# Altium schematic sheet MAIN_SCHE.SchDoc
size A3
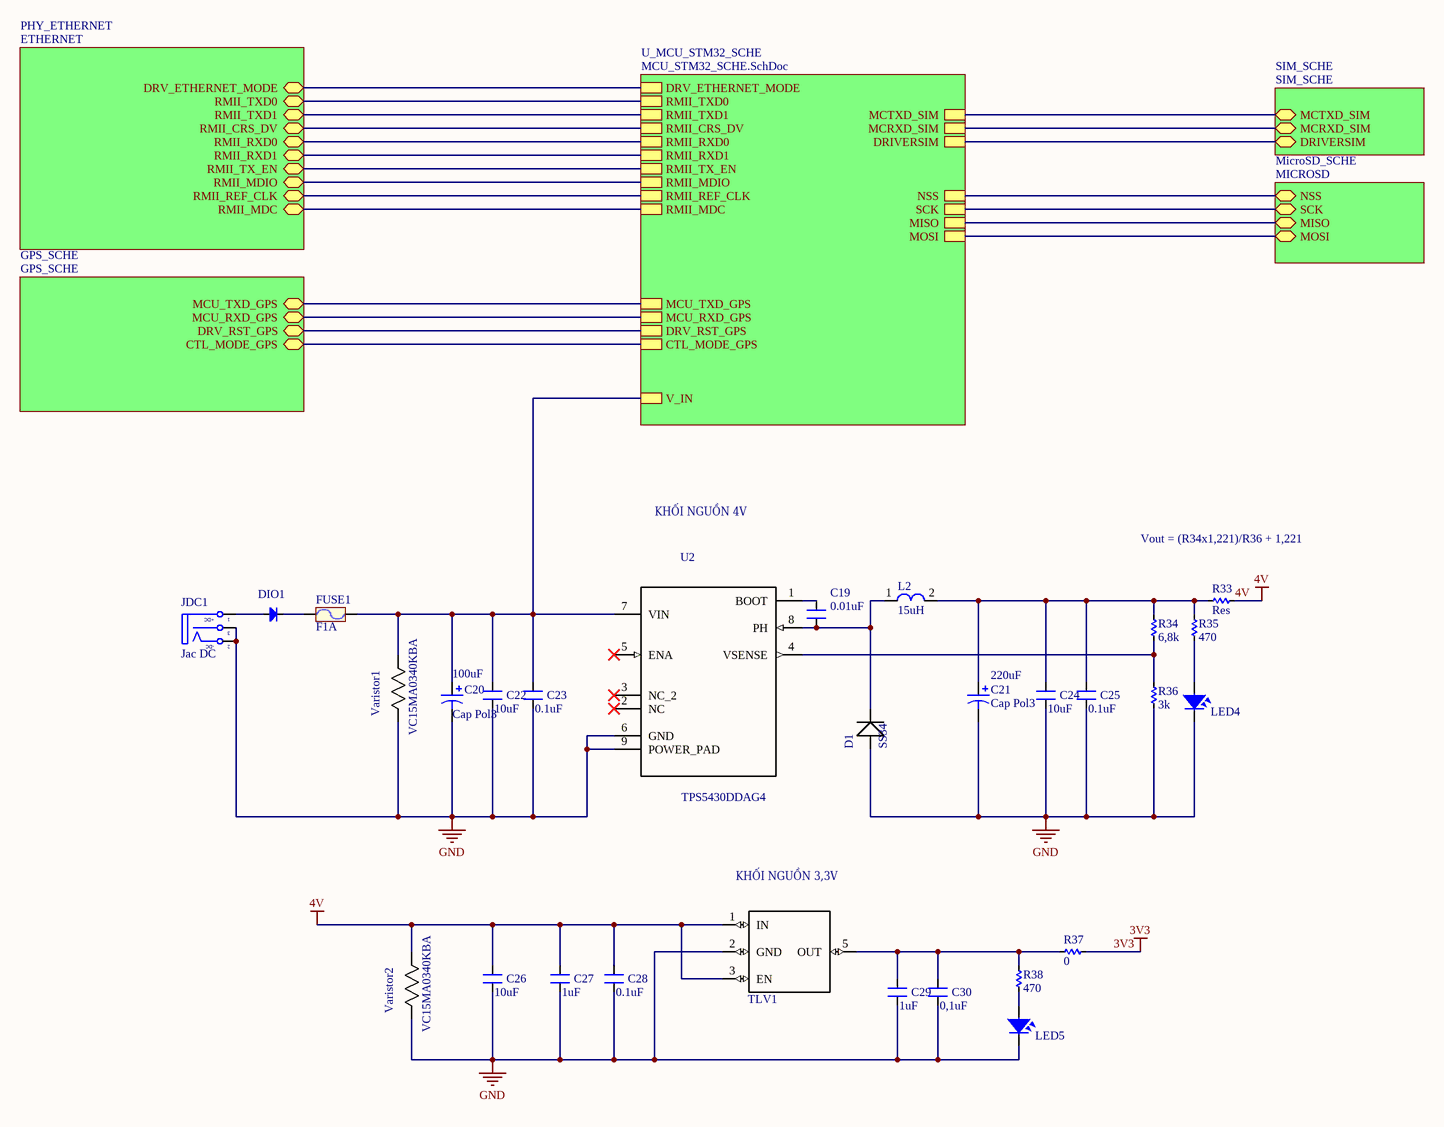
[diagram p0: MAIN_SCHE.SchDoc]

## Parts
C19  0.01uF  [res 0805 - duplicate]
C20  Cap Pol3  value 100uF  [cap_100uf]
C21  Cap Pol3  value 220uF  [Cap_tant_220uF]
C22  10uF  [res 0805 - duplicate]
C23  0.1uF  [res 0805 - duplicate]
C24  10uF  [res 0805 - duplicate]
C25  0.1uF  [res 0805 - duplicate]
C26  10uF  [res 0805 - duplicate]
C27  1uF  [res 0805 - duplicate]
C28  0.1uF  [res 0805 - duplicate]
C29  1uF  [res 0805 - duplicate]
C30  0,1uF  [res 0805 - duplicate]
D1  SS34  [SS34]
DIO1  Diode SMD  [DIOT-SS24]  (value not drawn)
FUSE1  F1A  [fuse]
JDC1  Jac DC  [DC-IN]
L2  15uH  [L-15uH]
LED4  LED  [res 0805 - duplicate]  (value not drawn)
LED5  LED  [res 0805 - duplicate]  (value not drawn)
R33  Res  [res 0805 - duplicate]
R34  6,8k  [res 0805 - duplicate]
R35  470  [res 0805 - duplicate]
R36  3k  [res 0805 - duplicate]
R37  0  [res 0805 - duplicate]
R38  470  [res 0805 - duplicate]
TLV1  TLV70233DBVR  [SOT23-5]  (value not drawn)
U2  TPS5430DDAG4  [SOIC127P600X170-9N]
Varistor1  VC15MA0340KBA  [varistor]
Varistor2  VC15MA0340KBA  [varistor]

## Sub-sheets
GPS_SCHE = GPS_SCHE: MCU_TXD_GPS, MCU_RXD_GPS, DRV_RST_GPS, CTL_MODE_GPS
MicroSD_SCHE = MICROSD: NSS, SCK, MISO, MOSI
PHY_ETHERNET = ETHERNET: DRV_ETHERNET_MODE, RMII_TXD0, RMII_TXD1, RMII_CRS_DV, RMII_RXD0, RMII_RXD1, RMII_TX_EN, RMII_MDIO, RMII_REF_CLK, RMII_MDC
SIM_SCHE = SIM_SCHE: MCTXD_SIM, MCRXD_SIM, DRIVERSIM
U_MCU_STM32_SCHE = MCU_STM32_SCHE.SchDoc: DRV_ETHERNET_MODE, RMII_TXD0, RMII_TXD1, RMII_CRS_DV, RMII_RXD0, RMII_RXD1, RMII_TX_EN, MCTXD_SIM, MCRXD_SIM, DRIVERSIM, MCU_TXD_GPS, MCU_RXD_GPS, DRV_RST_GPS, CTL_MODE_GPS, NSS, SCK, MISO, MOSI, RMII_MDIO, RMII_REF_CLK, RMII_MDC, V_IN

## Nets
3V3: R37.1
4V: C26.2 C27.2 C28.2 R33.1 TLV1.1(IN) TLV1.3(EN) Varistor2.1(R1)
GND: C20.2 C21.2 C22.1 C23.1 C24.1 C25.1 C26.1 C27.1 C28.1 C29.1 C30.1 D1.1(POS) JDC1.2(TN) JDC1.3(S) LED4.2 LED5.2 R36.2 TLV1.2(GND) U2.6(GND) U2.9(POWER_PAD) Varistor1.2(R2) Varistor2.2(R2)
NetC19_1: C19.1 D1.2(NEG) L2.1 U2.8(PH)
NetC19_2: C19.2 U2.1(BOOT)
NetC20_1: C20.1 C22.2 C23.2 FUSE1.2 U2.7(VIN) Varistor1.1(R1) ; sheet U_MCU_STM32_SCHE/V_IN
NetC21_1: C21.1 C24.2 C25.2 L2.2 R33.2 R34.1 R35.1
NetC29_2: C29.2 C30.2 R37.2 R38.2 TLV1.5(OUT)
NetDIO1_1: DIO1.1(A) JDC1.1(T)
NetDIO1_2: DIO1.2(K) FUSE1.1
NetLED4_1: LED4.1 R35.2
NetLED5_1: LED5.1 R38.1
NetR34_2: R34.2 R36.1 U2.4(VSENSE)
(unnamed): sheet U_MCU_STM32_SCHE/DRV_ETHERNET_MODE, sheet PHY_ETHERNET/DRV_ETHERNET_MODE
(unnamed): sheet U_MCU_STM32_SCHE/RMII_TXD0, sheet PHY_ETHERNET/RMII_TXD0
(unnamed): sheet U_MCU_STM32_SCHE/RMII_TXD1, sheet PHY_ETHERNET/RMII_TXD1
(unnamed): sheet U_MCU_STM32_SCHE/RMII_CRS_DV, sheet PHY_ETHERNET/RMII_CRS_DV
(unnamed): sheet U_MCU_STM32_SCHE/RMII_RXD0, sheet PHY_ETHERNET/RMII_RXD0
(unnamed): sheet U_MCU_STM32_SCHE/RMII_RXD1, sheet PHY_ETHERNET/RMII_RXD1
(unnamed): sheet U_MCU_STM32_SCHE/RMII_TX_EN, sheet PHY_ETHERNET/RMII_TX_EN
(unnamed): sheet U_MCU_STM32_SCHE/MCTXD_SIM, sheet SIM_SCHE/MCTXD_SIM
(unnamed): sheet U_MCU_STM32_SCHE/MCRXD_SIM, sheet SIM_SCHE/MCRXD_SIM
(unnamed): sheet U_MCU_STM32_SCHE/DRIVERSIM, sheet SIM_SCHE/DRIVERSIM
(unnamed): sheet U_MCU_STM32_SCHE/MCU_TXD_GPS, sheet GPS_SCHE/MCU_TXD_GPS
(unnamed): sheet U_MCU_STM32_SCHE/MCU_RXD_GPS, sheet GPS_SCHE/MCU_RXD_GPS
(unnamed): sheet U_MCU_STM32_SCHE/DRV_RST_GPS, sheet GPS_SCHE/DRV_RST_GPS
(unnamed): sheet U_MCU_STM32_SCHE/CTL_MODE_GPS, sheet GPS_SCHE/CTL_MODE_GPS
(unnamed): sheet U_MCU_STM32_SCHE/NSS, sheet MicroSD_SCHE/NSS
(unnamed): sheet U_MCU_STM32_SCHE/SCK, sheet MicroSD_SCHE/SCK
(unnamed): sheet U_MCU_STM32_SCHE/MISO, sheet MicroSD_SCHE/MISO
(unnamed): sheet U_MCU_STM32_SCHE/MOSI, sheet MicroSD_SCHE/MOSI
(unnamed): sheet U_MCU_STM32_SCHE/RMII_MDIO, sheet PHY_ETHERNET/RMII_MDIO
(unnamed): sheet U_MCU_STM32_SCHE/RMII_REF_CLK, sheet PHY_ETHERNET/RMII_REF_CLK
(unnamed): sheet U_MCU_STM32_SCHE/RMII_MDC, sheet PHY_ETHERNET/RMII_MDC

Not connected (* = marked no-connect by the designer): U2 2(NC)* 3(NC_2)* 5(ENA)*

## Notes on the sheet
- KHỐI NGUỒN 4V
- Vout = (R34x1,221)/R36 + 1,221
- (near TLV1) KHỐI NGUỒN 3,3V
- (in symbol DCIN) +DC; -DC

## Library data of the parts
C19 C22-C30 = CM: Cap SMD; Value: 103
C20 C21 = Cap Pol3: Polarized Capacitor (Surface Mount); Published: 8-Jun-2000; LatestRevisionDate: 29-May-2009; LatestRevisionNote: IPC-7351 Footprint Added.; PackageReference: C0805; Publisher: Altium Limited; PackageDescription: Chip Capacitor
  C20: wed: https://www.digikey.com/product-detail/en/avx-corporation/TCJE107M020R0045/478-9462-1-ND/5001674
  C21: wed: https://www.digikey.com/product-detail/en/avx-corporation/F930J227MBA/478-8168-6-ND/4006298
D1 = SMD-DIODE-SCHOTTKY-40V-3A(DO-214AB): Rectifier, Schottky; DO-214AB; 3.0A IF; 0.75V; 40V; 100A IFRM; 10000V/us; 1000pF; MF: Vishay; MP: SS34-E3/57T; Digi-Key_Part_Number: SS34-E3/57TGICT-ND; Digi-Key_Purchase_URL: https://www.digikey.com/product-detail/en/vishay-semiconductor-diodes-division/SS34-E3-57T/SS34-E3-57TGICT-ND/1091684?utm_source=snapeda&utm_medium=aggregator&utm_campaign=symbol; SnapEDA_Link: https://www.snapeda.com/parts/SS34-E3/57T/Vishay%20Semiconductor%20Diodes%20Division/view-part/?ref=snap; Package: DO-214 Vishay; Value: *
DIO1 = Diode SMD: Default Diode; Code - JEDEC: DO-214-AB; Value: 1N5007; Published: 8-Jun-2000; Revision: July-2002: Re-released for DXP Platform.; Publisher: Altium Limited
FUSE1 = Fuse: Designed by: VanDungEvn; wed: Fuse https://www.digikey.com/product-detail/en/littelfuse-inc/0466001.NR/F1456TR-ND/521337; Value: Fuse
JDC1 = DCIN: Jac DC input; Value: Jac DC
L2 = L-SMD-1: partNo: 78477010; Manufacturer: Wurth Elektronik; Inductance: 1.0 μH; ComponentLink1Description: Manufacturer; ComponentLink1URL: http://www.we-online.de; Created by: Baojun Chen; Created Date: Nov.2015; ComponentLink2Description: Datasheet; ComponentLink2URL: http://katalog.we-online.de/pbs/datasheet/78477010.pdf
LED4 LED5 = LED SMD: Value: LED 3 - 5 ly 2 Colour
R33-R38 = Res-SMD: Resistor; Manufacturer: Generic Components; Class: Passive; Published: 08/06/2000; Publisher: Altium Hobart Technology Centre
TLV1 = TLV70233DBVR: LDO voltage regulator [Texas Instruments] TLV70233DBVR LDO voltage regulator; MP: TLV70233DBVR; Price: 0.26 USD; Availability: Good; Package: SOT-23-5 Texas Instruments; SnapEDA_Link: https://www.snapeda.com/parts/TLV70233DBVR/Texas%20Instruments/view-part/?ref=snap; MF: Texas Instruments; Value: *
U2 = TPS5430DDAG4: 5.5V to 36V Input, 3A, 500kHz Step-Down Converter 8-SO PowerPAD -40 to 125; MF: Texas Instruments; MP: TPS5430DDAG4; Availability: Good; SnapEDA_Link: https://www.snapeda.com/parts/TPS5430DDAG4/Texas%20Instruments/view-part/?ref=snap; Price: 3.69 USD; Package: SO-8 Texas Instruments; Value: *
Varistor1 Varistor2 = VC15MA0340KBA: 2220 34 VDC 4000 pF Surface Mount Multilayer Ceramic Varistor; MF: AVX; Price: 0.96 USD; MP: VC15MA0340KBA; SnapEDA_Link: https://www.snapeda.com/parts/VC15MA0340KBA/AVX/view-part/?ref=snap; Availability: Good; Package: 2220 AVX; Value: *